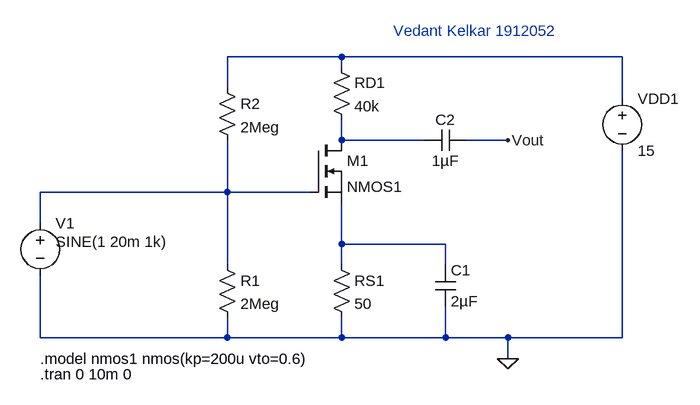
[diagram p0: schematic ECAD_lab4.asc]
ECAD_lab4.asc, the LTspice schematic file:
Version 4
SHEET 1 880 680
WIRE 256 -32 80 -32
WIRE 688 -32 256 -32
WIRE 256 -16 256 -32
WIRE 80 16 80 -32
WIRE 688 32 688 -32
WIRE 256 96 256 64
WIRE 384 96 256 96
WIRE 512 96 448 96
WIRE 256 112 256 96
WIRE 80 176 80 96
WIRE 80 176 -208 176
WIRE 208 176 80 176
WIRE -208 224 -208 176
WIRE 256 256 256 192
WIRE 416 256 256 256
WIRE 80 288 80 176
WIRE 256 288 256 256
WIRE 416 288 416 256
WIRE -208 400 -208 304
WIRE 80 400 80 368
WIRE 80 400 -208 400
WIRE 256 400 256 368
WIRE 256 400 80 400
WIRE 416 400 416 352
WIRE 416 400 256 400
WIRE 512 400 416 400
WIRE 688 400 688 112
WIRE 688 400 512 400
WIRE 512 432 512 400
FLAG 512 96 Vout
FLAG 512 432 0
SYMBOL res 240 -32 R0
SYMATTR InstName RD1
SYMATTR Value 40k
SYMBOL res 64 272 R0
SYMATTR InstName R1
SYMATTR Value 2Meg
SYMBOL res 240 272 R0
SYMATTR InstName RS1
SYMATTR Value 50
SYMBOL cap 400 288 R0
SYMATTR InstName C1
SYMATTR Value 2µF
SYMBOL cap 448 80 R90
WINDOW 0 0 32 VBottom 2
WINDOW 3 32 32 VTop 2
SYMATTR InstName C2
SYMATTR Value 1µF
SYMBOL voltage -208 208 R0
WINDOW 123 24 124 Left 2
WINDOW 39 0 0 Left 0
WINDOW 3 24 44 Left 2
SYMATTR Value SINE(1 20m 1k)
SYMATTR InstName V1
SYMBOL voltage 688 16 R0
WINDOW 123 0 0 Left 0
WINDOW 39 0 0 Left 0
SYMATTR InstName VDD1
SYMATTR Value 15
SYMBOL nmos 208 96 R0
SYMATTR InstName M1
SYMATTR Value NMOS1
SYMBOL res 64 0 R0
SYMATTR InstName R2
SYMATTR Value 2Meg
TEXT 336 -72 Left 2 ;Vedant Kelkar 1912052
TEXT -208 432 Left 2 !.model nmos1 nmos(kp=200u vto=0.6)
TEXT -208 456 Left 2 !.tran 0 10m 0

The netlist it stands for:
* ECAD_lab4.asc
RD1 N001 N002 40k
R1 N003 0 2Meg
RS1 N004 0 50
C1 N004 0 2µF
C2 Vout N002 1µF
V1 N003 0 SINE(1 20m 1k)
VDD1 N001 0 15
M1 N002 N003 N004 N004 NMOS1
R2 N001 N003 2Meg
.model NMOS NMOS
.model PMOS PMOS
.lib standard.mos
* Vedant Kelkar 1912052
.model nmos1 nmos(kp=200u vto=0.6)
.tran 0 10m 0
.backanno
.end